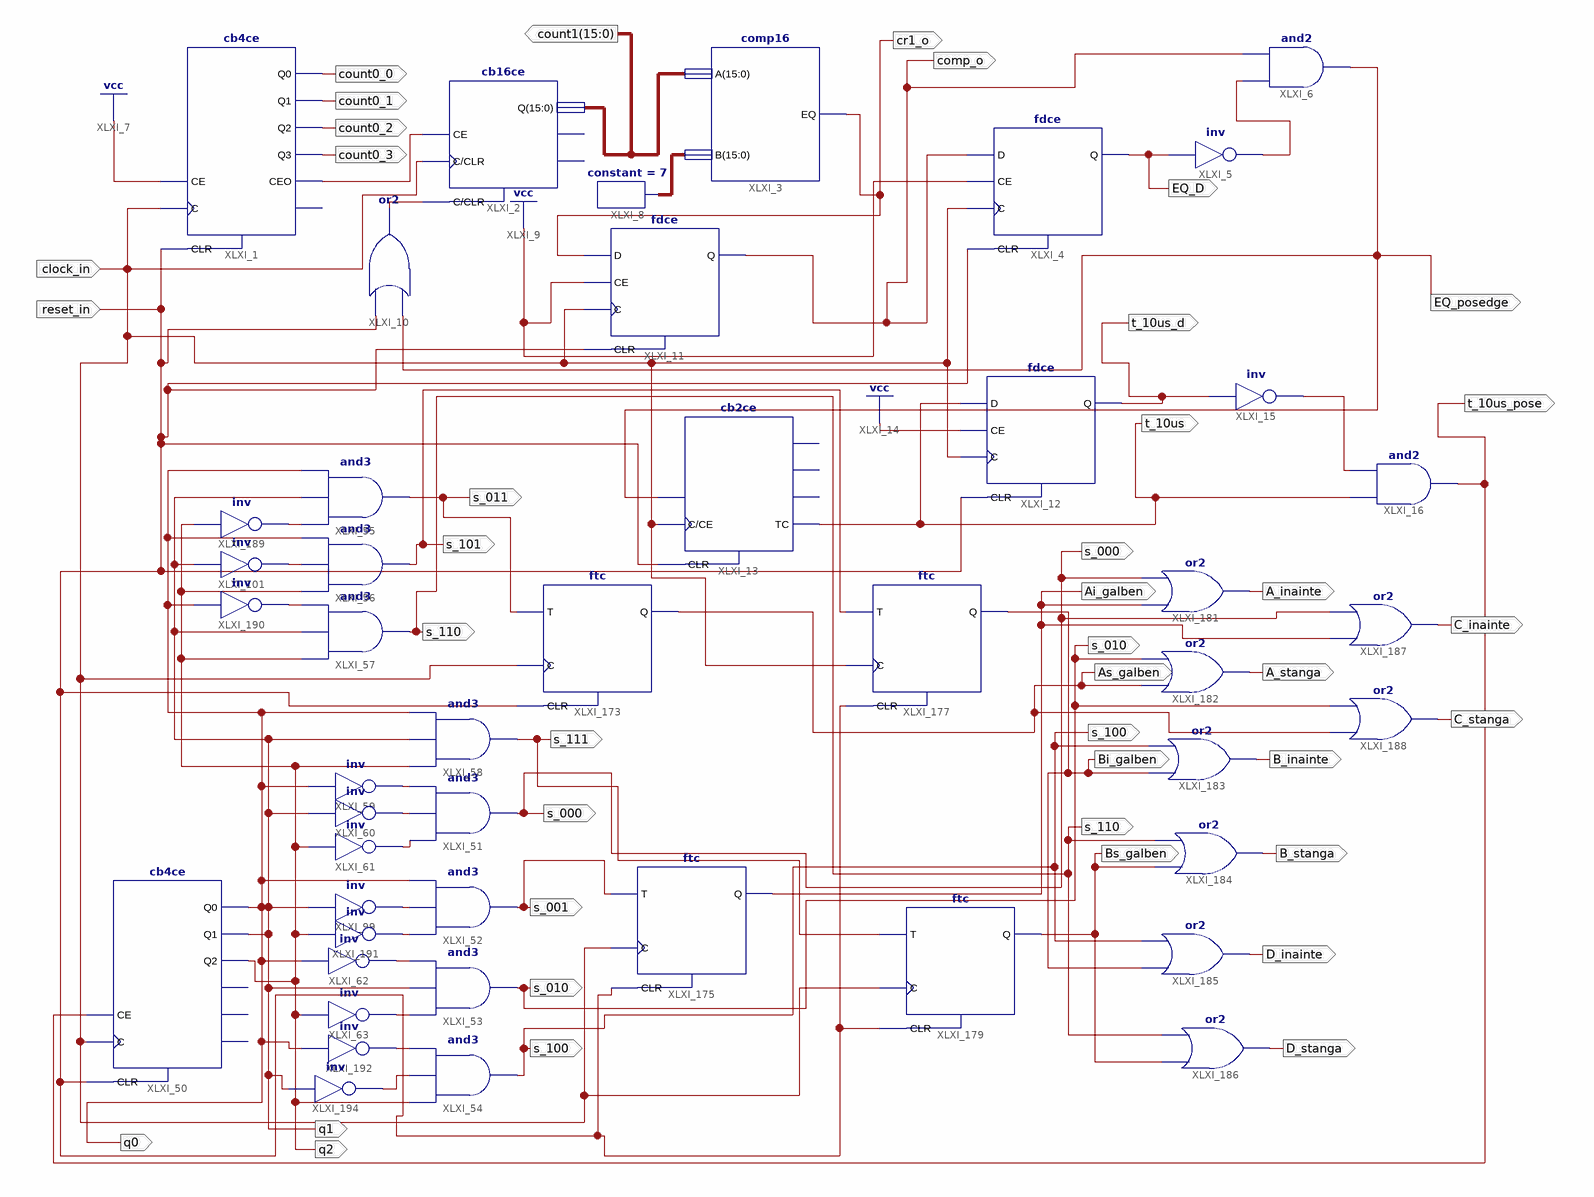
[diagram p0: schematic sheet 1]
// Xilinx ISE schematic prima_schema.sch (artix7) as structural Verilog: 46 symbols, 37 ports
module prima_schema (
  input  clock_in,
  input  reset_in,
  output [15:0] count1,
  output count0_0,
  output count0_1,
  output count0_2,
  output count0_3,
  output EQ_posedge,
  output comp_o,
  output cr1_o,
  output EQ_D,
  output t_10us_d,
  output t_10us,
  output t_10us_pose,
  output s_001,
  output As_galben,
  output s_100,
  output Ai_galben,
  output s_010,
  output s_000,
  output s_111,
  output s_011,
  output s_101,
  output s_110,
  output q2,
  output q1,
  output q0,
  output D_stanga,
  output D_inainte,
  output C_stanga,
  output C_inainte,
  output B_stanga,
  output Bs_galben,
  output B_inainte,
  output Bi_galben,
  output A_stanga,
  output A_inainte
);

  wire XLXN_1, XLXN_11, XLXN_35, XLXN_134, XLXN_135, XLXN_136, XLXN_138, XLXN_139, XLXN_211, XLXN_222,
       XLXN_494, XLXN_495, XLXN_496, XLXN_497, XLXN_498;
  wire [15:0] XLXN_471;

  cb4ce XLXI_50 (.C(clock_in), .CE(t_10us_pose), .CLR(reset_in), .Q0(q0), .Q1(q1), .Q2(q2));  // open: CEO, Q3, TC
  cb4ce XLXI_1 (
    .C(clock_in), .CE(1'b1), .CLR(reset_in), .CEO(XLXN_1), .Q0(count0_0), .Q1(count0_1), .Q2(count0_2),
    .Q3(count0_3));  // open: TC
  fdce XLXI_4 (.C(clock_in), .CE(1'b1), .CLR(reset_in), .D(comp_o), .Q(EQ_D));
  not XLXI_5 (XLXN_11, EQ_D);
  and XLXI_6 (EQ_posedge, XLXN_11, comp_o);
  cb16ce XLXI_2 (.C(clock_in), .CE(XLXN_1), .CLR(clock_in), .Q(count1));  // open: CEO, TC
  comp16 XLXI_3 (.A(count1), .B(XLXN_471), .EQ(cr1_o));
  constant #(.CValue("7")) XLXI_8 (.O(XLXN_471));
  or XLXI_10 (clock_in, EQ_posedge, reset_in);
  fdce XLXI_11 (.C(clock_in), .CE(1'b1), .CLR(reset_in), .D(cr1_o), .Q(comp_o));
  cb2ce XLXI_13 (.C(clock_in), .CE(clock_in), .CLR(reset_in), .TC(t_10us));  // open: CEO, Q0, Q1
  fdce XLXI_12 (.C(clock_in), .CE(1'b1), .CLR(reset_in), .D(t_10us), .Q(t_10us_d));
  not XLXI_15 (XLXN_35, t_10us_d);
  and XLXI_16 (t_10us_pose, t_10us, XLXN_35);
  not XLXI_99 (XLXN_211, q1);
  not XLXI_62 (XLXN_138, q0);
  not XLXI_63 (XLXN_139, q2);
  and XLXI_54 (s_100, q2, XLXN_498, XLXN_497);
  and XLXI_53 (s_010, XLXN_139, q1, XLXN_138);
  and XLXI_52 (s_001, XLXN_496, XLXN_211, q0);
  ftc XLXI_177 (.C(clock_in), .CLR(reset_in), .T(s_101), .Q(Bi_galben));
  ftc XLXI_179 (.C(clock_in), .CLR(reset_in), .T(s_111), .Q(Bs_galben));
  ftc XLXI_175 (.C(clock_in), .CLR(reset_in), .T(s_001), .Q(Ai_galben));
  not XLXI_61 (XLXN_136, q2);
  not XLXI_59 (XLXN_134, q0);
  not XLXI_60 (XLXN_135, q1);
  and XLXI_51 (s_000, XLXN_136, XLXN_135, XLXN_134);
  and XLXI_58 (s_111, q2, q1, q0);
  ftc XLXI_173 (.C(clock_in), .CLR(reset_in), .T(s_011), .Q(As_galben));
  and XLXI_57 (s_110, q2, q1, XLXN_495);
  not XLXI_101 (XLXN_222, q1);
  and XLXI_56 (s_101, q2, XLXN_222, q0);
  and XLXI_55 (s_011, XLXN_494, q1, q0);
  or XLXI_188 (C_stanga, As_galben, s_010);
  or XLXI_187 (C_inainte, Ai_galben, s_000);
  or XLXI_184 (B_stanga, Bs_galben, s_110);
  or XLXI_183 (B_inainte, Bi_galben, s_100);
  or XLXI_182 (A_stanga, As_galben, s_010);
  or XLXI_181 (A_inainte, Ai_galben, s_000);
  or XLXI_186 (D_stanga, Bs_galben, s_110);
  or XLXI_185 (D_inainte, Bi_galben, s_100);
  not XLXI_189 (XLXN_494, q2);
  not XLXI_190 (XLXN_495, q0);
  not XLXI_191 (XLXN_496, q2);
  not XLXI_192 (XLXN_497, q0);
  not XLXI_194 (XLXN_498, q1);
endmodule
